# Altium schematic sheet IO_Expander.SchDoc
size A; SheetNumber: 5; SheetTotal: 9
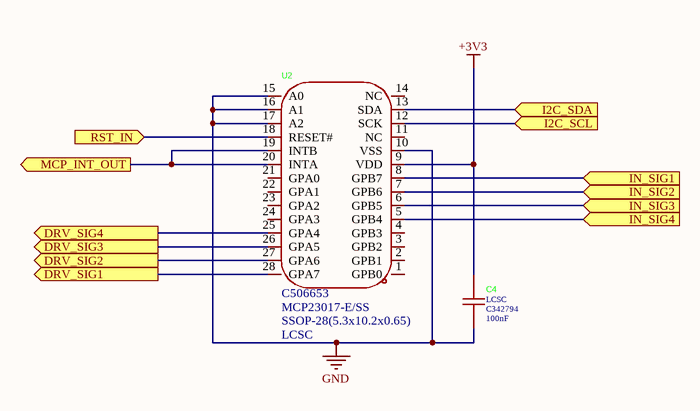
[diagram p0: IO_Expander.SchDoc]

## Parts
C4  Supplier: LCSC  Supplier Part: C342794  [CAP-TH_L4.0-W2.5-P5.00-D1.0]  (hidden comment: 100nF)
U2  Supplier Part: C506653  Supplier Footprint: SSOP-28(5.3x10.2x0.65)  Supplier: LCSC  [SSOP-28_L10.2-W5.3-P0.65-LS7.8-BL]  (hidden comment: MCP23017-E/SS)

## Ports
DRV_SIG1 (out), DRV_SIG2 (out), DRV_SIG3 (out), DRV_SIG4 (out), I2C_SCL (in), I2C_SDA (in), IN_SIG1 (in), IN_SIG2 (in), IN_SIG3 (in), IN_SIG4 (in), MCP_INT_OUT (out), RST_IN (in)

## Nets
+3V3: C4.2 U2.9(VDD)
GND: C4.1 U2.10(VSS) U2.15(A0) U2.16(A1) U2.17(A2)
DRV_SIG1: U2.28(GPA7) ; port DRV_SIG1
DRV_SIG2: U2.27(GPA6) ; port DRV_SIG2
DRV_SIG3: U2.26(GPA5) ; port DRV_SIG3
DRV_SIG4: U2.25(GPA4) ; port DRV_SIG4
I2C_SCL: U2.12(SCK) ; port I2C_SCL
I2C_SDA: U2.13(SDA) ; port I2C_SDA
IN_SIG1: U2.8(GPB7) ; port IN_SIG1
IN_SIG2: U2.7(GPB6) ; port IN_SIG2
IN_SIG3: U2.6(GPB5) ; port IN_SIG3
IN_SIG4: U2.5(GPB4) ; port IN_SIG4
MCP_INT_OUT: U2.19(INTB) U2.20(INTA) ; port MCP_INT_OUT
RST_IN: U2.18(RESET#) ; port RST_IN

Not connected (* = marked no-connect by the designer): U2 1(GPB0) 2(GPB1) 3(GPB2) 4(GPB3) 11(NC) 14(NC) 21(GPA0) 22(GPA1) 23(GPA2) 24(GPA3)

## Library data of the parts
C4 = FG28X7R1H104KNT06: Manufacturer: TDK; Add into BOM: yes; Tolerance: ±10%; Voltage Rating: 50V; Temperature Coefficient: X7R; Pin Spacing: 5mm; Symbol: FG28X7R1H104KNT06; Device: FG28X7R1H104KNT06; LCSC Part Name: 100nF ±10% 50V; Manufacturer Part: FG28X7R1H104KNT06; Supplier Footprint: 插件,P=5mm; JLCPCB Part Class: Extended Part; Datasheet: https://item.szlcsc.com/datasheet/FG28X7R1H104KNT06/319644.html; Convert to PCB: yes; Value: 100nF
U2 = MCP23017-E/SS: Manufacturer: MICROCHIP(美国微芯); Add into BOM: yes; Interface: I2C; Number of I/O: 16; Voltage - Supply: 1.8V~5.5V; Current - Output Low(IOL): 8mA; Clock Frequency: 1.7MHz; Number of Supporting Devices: 8; Quiescent Current: 1uA; Output Logic Level - Low: 600mV; Symbol: MCP23017-E/SS; Device: MCP23017-E/SS; LCSC Part Name: 16位带串行接口的I/O扩展器; JLCPCB Part Class: Extended Part; Datasheet: https://item.szlcsc.com/datasheet/MCP23017-E%252FSS/519857.html; Convert to PCB: yes; Interrupt Output: Interrupt Output; Output Type: -; Current - Output High(IOH): -; Operating Temperature: -40℃~+125℃; Manufacturer Part: MCP23017-E/SS